# Altium project MainBoard.PrjPcb
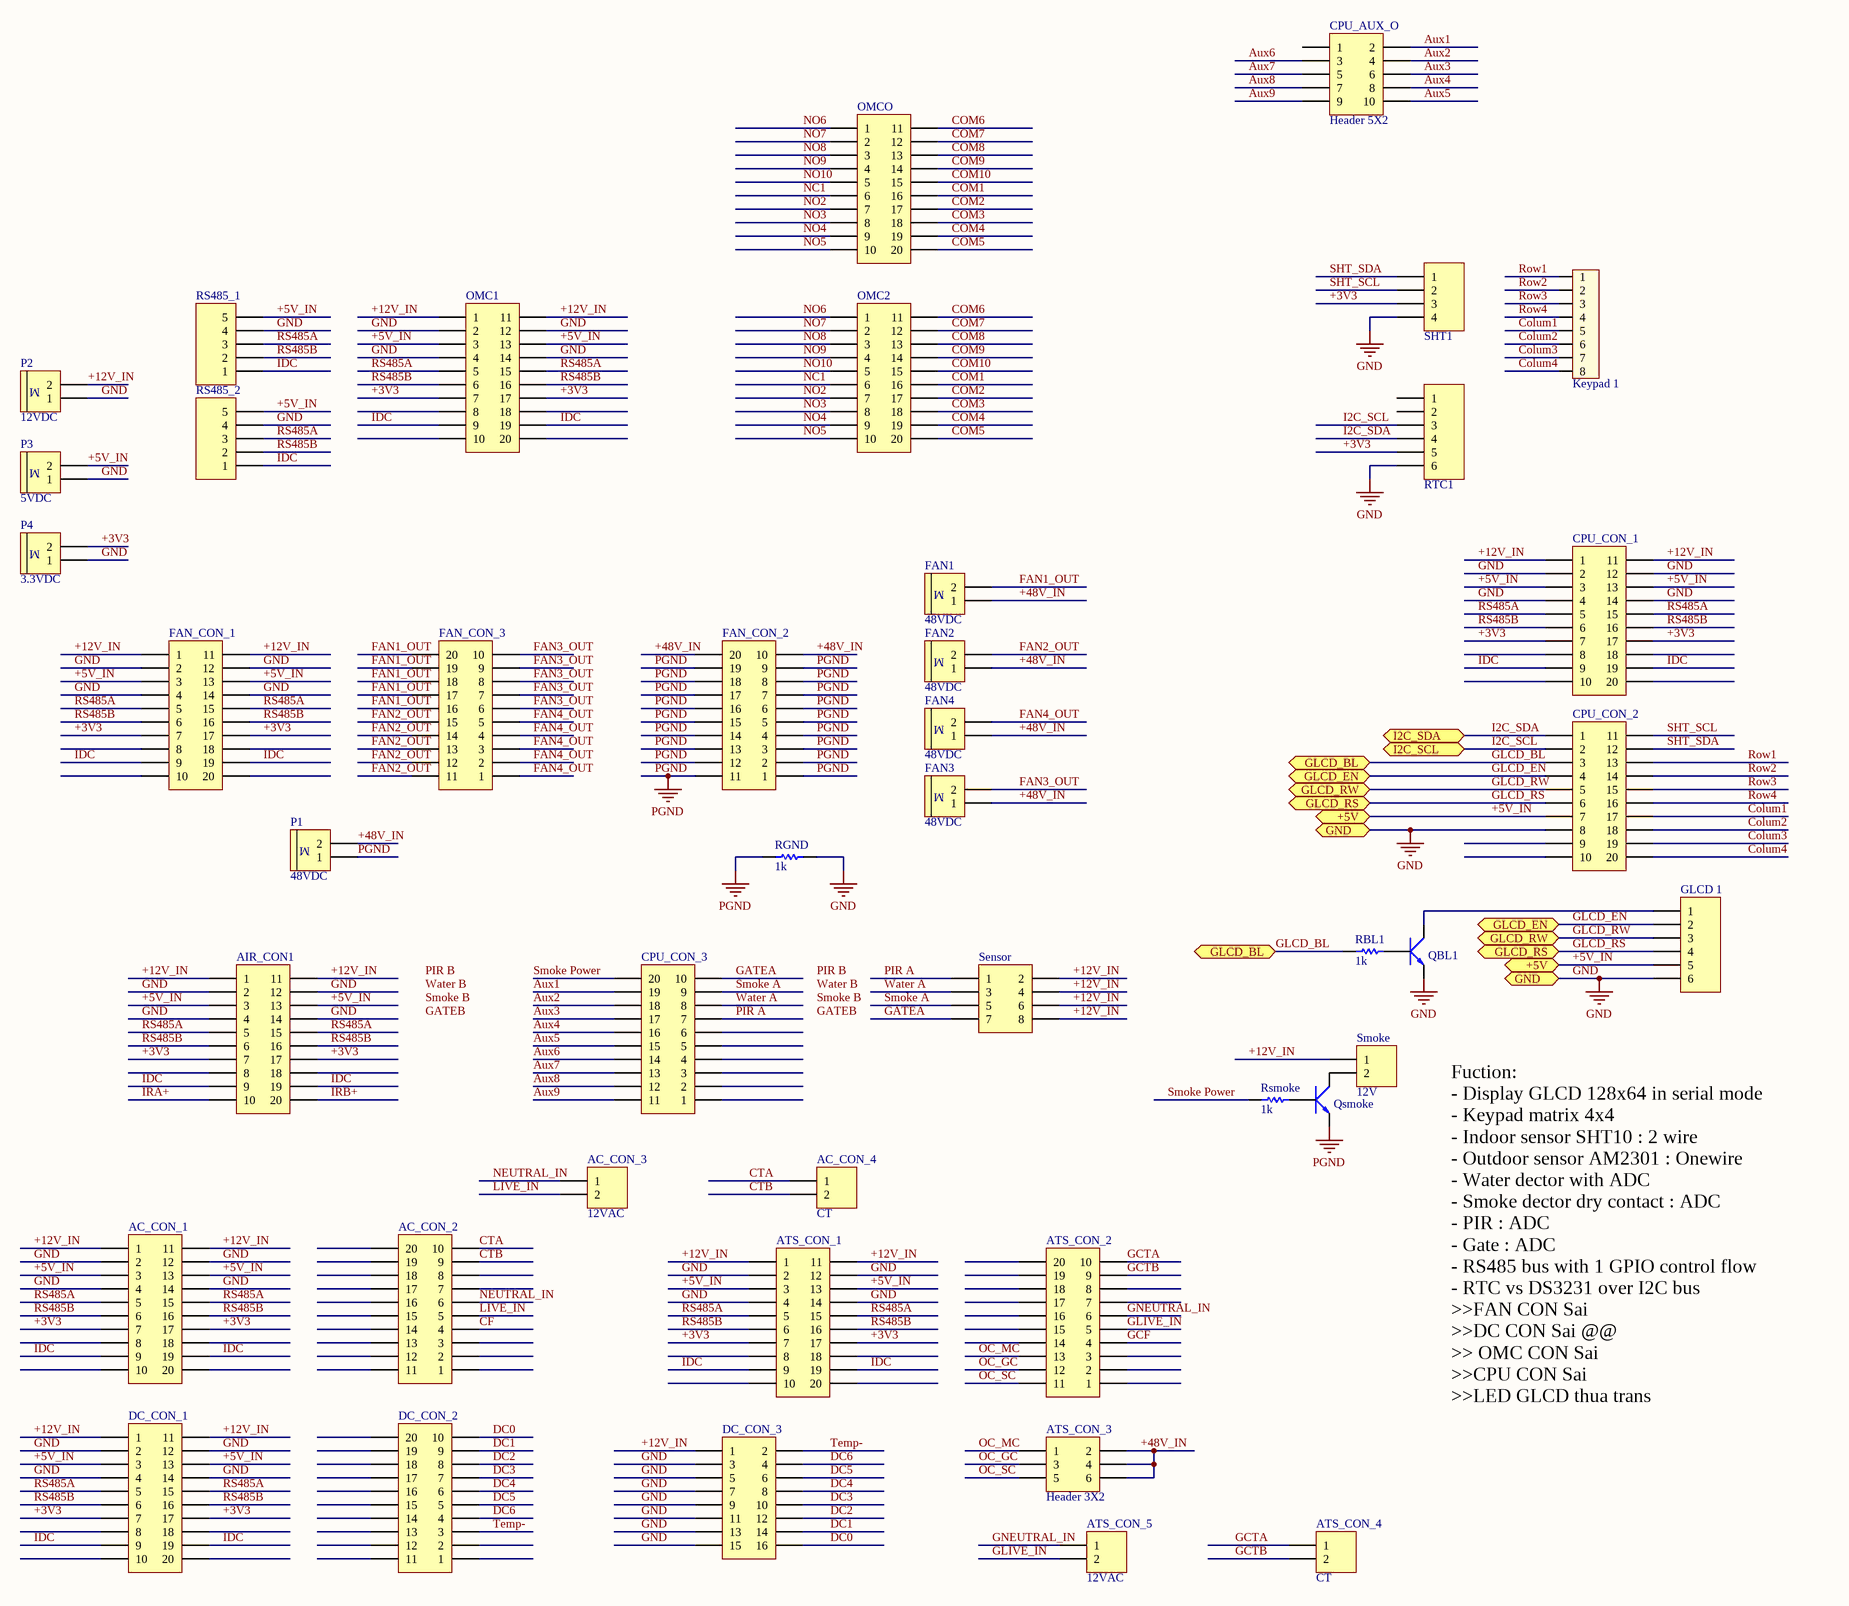
[diagram p0: MainBoard.SchDoc]
1 sheet, 44 parts. Net scope: flat (ports and power ports of the same name join across sheets).
Board file: MainBoard_Tuan.PcbDoc

## Sheet MainBoard.SchDoc
size A2

### Parts
AC_CON_1  Header 10X2A  [HDR2X10_CEN]  (value not drawn)
AC_CON_2  Header 10X2A  [HDR2X10_CEN]  (value not drawn)
AC_CON_3  12VAC  [HDR1X2]
AC_CON_4  CT  [HDR1X2]
AIR_CON1  Header 10X2A  [HDR2X10_CEN]  (value not drawn)
ATS_CON_1  Header 10X2A  [HDR2X10_CEN]  (value not drawn)
ATS_CON_2  Header 10X2A  [HDR2X10_CEN]  (value not drawn)
ATS_CON_3  Header 3X2  [HDR2X3]
ATS_CON_4  CT  [HDR1X2]
ATS_CON_5  12VAC  [HDR1X2]
CPU_AUX_O  Header 5X2  [HDR2X5]
CPU_CON_1  Header 10X2A  [HDR2X10_CEN]  (value not drawn)
CPU_CON_2  Header 10X2A  [HDR2X10_CEN]  (value not drawn)
CPU_CON_3  Header 10X2A  [HDR2X10_CEN]  (value not drawn)
DC_CON_1  Header 10X2A  [HDR2X10_CEN]  (value not drawn)
DC_CON_2  Header 10X2A  [HDR2X10_CEN]  (value not drawn)
DC_CON_3  Header 8X2  [HDR2X8]  (value not drawn)
FAN1  48VDC  [Medium - Header 2]
FAN2  48VDC  [Medium - Header 2]
FAN3  48VDC  [Medium - Header 2]
FAN4  48VDC  [Medium - Header 2]
FAN_CON_1  Header 10X2A  [HDR2X10_CEN]  (value not drawn)
FAN_CON_2  Header 10X2A  [HDR2X10_CEN]  (value not drawn)
FAN_CON_3  Header 10X2A  [HDR2X10_CEN]  (value not drawn)
GLCD_1  Header 6  [HDR1X6]  (value not drawn)
Keypad_1  JP8  [CON8]  (value not drawn)
OMC1  Header 10X2A  [HDR2X10_CEN]  (value not drawn)
OMC2  Header 10X2A  [HDR2X10_CEN]  (value not drawn)
OMCO  Header 10X2A  [HDR2X10_CEN]  (value not drawn)
P1  48VDC  [Medium - Header 2]
P2  12VDC  [Medium - Header 2]
P3  5VDC  [Medium - Header 2]
P4  3.3VDC  [Medium - Header 2]
QBL1  C828  [QTO-92B]  (value not drawn)
Qsmoke  C828  [QTO-92B]  (value not drawn)
RBL1  value 1k  [AXIAL-0.4]  (hidden comment: Res)
RGND  value 1k  [AXIAL-0.4]  (hidden comment: Res)
RS485_1  Header 5  [HDR1X5]  (value not drawn)
RS485_2  Header 5  [HDR1X5]  (value not drawn)
Rsmoke  value 1k  [AXIAL-0.4]  (hidden comment: Res)
RTC1  Header 6  [HDR1X6]  (value not drawn)
Sensor  Header 4X2  [HDR2X4]  (value not drawn)
SHT1  Header 4  [HDR1X4]  (value not drawn)
Smoke  12V  [HDR1X2]

### Ports
+5V, GLCD_BL, GLCD_EN, GLCD_RS, GLCD_RW, GND, I2C_SCL, I2C_SDA

### Nets
GND: AC_CON_1.2 AC_CON_1.4 AC_CON_1.12 AC_CON_1.14 AIR_CON1.2 AIR_CON1.4 AIR_CON1.12 AIR_CON1.14 ATS_CON_1.2 ATS_CON_1.4 ATS_CON_1.12 ATS_CON_1.14 CPU_CON_1.2 CPU_CON_1.4 CPU_CON_1.12 CPU_CON_1.14 CPU_CON_2.8 DC_CON_1.2 DC_CON_1.4 DC_CON_1.12 DC_CON_1.14 DC_CON_3.3 DC_CON_3.5 DC_CON_3.7 DC_CON_3.9 DC_CON_3.11 DC_CON_3.13 DC_CON_3.15 FAN_CON_1.2 FAN_CON_1.4 FAN_CON_1.12 FAN_CON_1.14 GLCD_1.6 OMC1.2 OMC1.4 OMC1.12 OMC1.14 P2.1 P3.1 P4.1 QBL1.3(E) RGND.2 RS485_1.4 RS485_2.4 RTC1.6 SHT1.4 ; port GND
PGND: FAN_CON_2.1 FAN_CON_2.2 FAN_CON_2.3 FAN_CON_2.4 FAN_CON_2.5 FAN_CON_2.6 FAN_CON_2.7 FAN_CON_2.8 FAN_CON_2.9 FAN_CON_2.11 FAN_CON_2.12 FAN_CON_2.13 FAN_CON_2.14 FAN_CON_2.15 FAN_CON_2.16 FAN_CON_2.17 FAN_CON_2.18 FAN_CON_2.19 P1.1 Qsmoke.3(E) RGND.1
+3V3: AC_CON_1.7 AC_CON_1.17 AIR_CON1.7 AIR_CON1.17 ATS_CON_1.7 ATS_CON_1.17 CPU_CON_1.7 CPU_CON_1.17 DC_CON_1.7 DC_CON_1.17 FAN_CON_1.7 FAN_CON_1.17 OMC1.7 OMC1.17 P4.2 RTC1.5 SHT1.3
+5V_IN: AC_CON_1.3 AC_CON_1.13 AIR_CON1.3 AIR_CON1.13 ATS_CON_1.3 ATS_CON_1.13 CPU_CON_1.3 CPU_CON_1.13 CPU_CON_2.7 DC_CON_1.3 DC_CON_1.13 FAN_CON_1.3 FAN_CON_1.13 GLCD_1.5 OMC1.3 OMC1.13 P3.2 RS485_1.5 RS485_2.5 ; port +5V
+12V_IN: AC_CON_1.1 AC_CON_1.11 AIR_CON1.1 AIR_CON1.11 ATS_CON_1.1 ATS_CON_1.11 CPU_CON_1.1 CPU_CON_1.11 DC_CON_1.1 DC_CON_1.11 DC_CON_3.1 FAN_CON_1.1 FAN_CON_1.11 OMC1.1 OMC1.11 P2.2 Sensor.2 Sensor.4 Sensor.6 Sensor.8 Smoke.1
+48V_IN: ATS_CON_3.2 ATS_CON_3.4 ATS_CON_3.6 FAN1.1 FAN2.1 FAN3.1 FAN4.1 FAN_CON_2.10 FAN_CON_2.20 P1.2
Aux1: CPU_AUX_O.2 CPU_CON_3.19
Aux2: CPU_AUX_O.4 CPU_CON_3.18
Aux3: CPU_AUX_O.6 CPU_CON_3.17
Aux4: CPU_AUX_O.8 CPU_CON_3.16
Aux5: CPU_AUX_O.10 CPU_CON_3.15
Aux6: CPU_AUX_O.3 CPU_CON_3.14
Aux7: CPU_AUX_O.5 CPU_CON_3.13
Aux8: CPU_AUX_O.7 CPU_CON_3.12
Aux9: CPU_AUX_O.9 CPU_CON_3.11
CF: AC_CON_2.4
Colum1: CPU_CON_2.17 Keypad_1.5
Colum2: CPU_CON_2.18 Keypad_1.6
Colum3: CPU_CON_2.19 Keypad_1.7
Colum4: CPU_CON_2.20 Keypad_1.8
COM1: OMC2.16 OMCO.16
COM2: OMC2.17 OMCO.17
COM3: OMC2.18 OMCO.18
COM4: OMC2.19 OMCO.19
COM5: OMC2.20 OMCO.20
COM6: OMC2.11 OMCO.11
COM7: OMC2.12 OMCO.12
COM8: OMC2.13 OMCO.13
COM9: OMC2.14 OMCO.14
COM10: OMC2.15 OMCO.15
CTA: AC_CON_2.10 AC_CON_4.1
CTB: AC_CON_2.9 AC_CON_4.2
DC0: DC_CON_2.10 DC_CON_3.16
DC1: DC_CON_2.9 DC_CON_3.14
DC2: DC_CON_2.8 DC_CON_3.12
DC3: DC_CON_2.7 DC_CON_3.10
DC4: DC_CON_2.6 DC_CON_3.8
DC5: DC_CON_2.5 DC_CON_3.6
DC6: DC_CON_2.4 DC_CON_3.4
FAN1_OUT: FAN1.2 FAN_CON_3.16 FAN_CON_3.17 FAN_CON_3.18 FAN_CON_3.19 FAN_CON_3.20
FAN2_OUT: FAN2.2 FAN_CON_3.11 FAN_CON_3.12 FAN_CON_3.13 FAN_CON_3.14 FAN_CON_3.15
FAN3_OUT: FAN3.2 FAN_CON_3.6 FAN_CON_3.7 FAN_CON_3.8 FAN_CON_3.9 FAN_CON_3.10
FAN4_OUT: FAN4.2 FAN_CON_3.1 FAN_CON_3.2 FAN_CON_3.3 FAN_CON_3.4 FAN_CON_3.5
GATEA: CPU_CON_3.10 Sensor.7
GCF: ATS_CON_2.4
GCTA: ATS_CON_2.10 ATS_CON_4.1
GCTB: ATS_CON_2.9 ATS_CON_4.2
GLCD_BL: CPU_CON_2.3 RBL1.1 ; port GLCD_BL
GLCD_EN: CPU_CON_2.4 GLCD_1.2 ; port GLCD_EN
GLCD_RS: CPU_CON_2.6 GLCD_1.4 ; port GLCD_RS
GLCD_RW: CPU_CON_2.5 GLCD_1.3 ; port GLCD_RW
GLIVE_IN: ATS_CON_2.5 ATS_CON_5.2
GNEUTRAL_IN: ATS_CON_2.6 ATS_CON_5.1
I2C_SCL: CPU_CON_2.2 RTC1.3 ; port I2C_SCL
I2C_SDA: CPU_CON_2.1 RTC1.4 ; port I2C_SDA
IDC: AC_CON_1.9 AC_CON_1.19 AIR_CON1.9 AIR_CON1.19 ATS_CON_1.9 ATS_CON_1.19 CPU_CON_1.9 CPU_CON_1.19 DC_CON_1.9 DC_CON_1.19 FAN_CON_1.9 FAN_CON_1.19 OMC1.9 OMC1.19 RS485_1.1 RS485_2.1
IRA+: AIR_CON1.10
IRB+: AIR_CON1.20
LIVE_IN: AC_CON_2.5 AC_CON_3.2
NC1: OMC2.6 OMCO.6
NEUTRAL_IN: AC_CON_2.6 AC_CON_3.1
NO2: OMC2.7 OMCO.7
NO3: OMC2.8 OMCO.8
NO4: OMC2.9 OMCO.9
NO5: OMC2.10 OMCO.10
NO6: OMC2.1 OMCO.1
NO7: OMC2.2 OMCO.2
NO8: OMC2.3 OMCO.3
NO9: OMC2.4 OMCO.4
NO10: OMC2.5 OMCO.5
OC_GC: ATS_CON_2.12 ATS_CON_3.3
OC_MC: ATS_CON_2.13 ATS_CON_3.1
OC_SC: ATS_CON_2.11 ATS_CON_3.5
PIR A: CPU_CON_3.7 Sensor.1
Row1: CPU_CON_2.13 Keypad_1.1
Row2: CPU_CON_2.14 Keypad_1.2
Row3: CPU_CON_2.15 Keypad_1.3
Row4: CPU_CON_2.16 Keypad_1.4
RS485A: AC_CON_1.5 AC_CON_1.15 AIR_CON1.5 AIR_CON1.15 ATS_CON_1.5 ATS_CON_1.15 CPU_CON_1.5 CPU_CON_1.15 DC_CON_1.5 DC_CON_1.15 FAN_CON_1.5 FAN_CON_1.15 OMC1.5 OMC1.15 RS485_1.3 RS485_2.3
RS485B: AC_CON_1.6 AC_CON_1.16 AIR_CON1.6 AIR_CON1.16 ATS_CON_1.6 ATS_CON_1.16 CPU_CON_1.6 CPU_CON_1.16 DC_CON_1.6 DC_CON_1.16 FAN_CON_1.6 FAN_CON_1.16 OMC1.6 OMC1.16 RS485_1.2 RS485_2.2
SHT_SCL: CPU_CON_2.11 SHT1.2
SHT_SDA: CPU_CON_2.12 SHT1.1
Smoke A: CPU_CON_3.9 Sensor.5
Smoke Power: CPU_CON_3.20 Rsmoke.1
Temp-: DC_CON_2.3 DC_CON_3.2
Water A: CPU_CON_3.8 Sensor.3
NetGLCD_1_1: GLCD_1.1 QBL1.2(C)
NetQBL1_1: QBL1.1(B) RBL1.2
NetQsmoke_1: Qsmoke.1(B) Rsmoke.2
NetQsmoke_2: Qsmoke.2(C) Smoke.2

Not connected (* = marked no-connect by the designer): AC_CON_1 8 10 18 20; AC_CON_2 1 2 3 7 8 11 12 13 14 15 16 17 18 19 20; AIR_CON1 8 18; ATS_CON_1 8 10 18 20; ATS_CON_2 1 2 3 7 8 14 15 16 17 18 19 20; CPU_AUX_O 1; CPU_CON_1 8 10 18 20; CPU_CON_2 9 10; CPU_CON_3 1 2 3 4 5 6; DC_CON_1 8 10 18 20; DC_CON_2 1 2 11 12 13 14 15 16 17 18 19 20; FAN_CON_1 8 10 18 20; OMC1 8 10 18 20; RTC1 1 2

### Notes on the sheet
- Fuction:
  - Display GLCD 128x64 in serial mode
  - Keypad matrix 4x4
  - Indoor sensor SHT10 : 2 wire
  - Outdoor sensor AM2301 : Onewire
  - Water dector with ADC
  - Smoke dector dry contact : ADC
  - PIR : ADC
  - Gate : ADC
  - RS485 bus with 1 GPIO control flow
  - RTC vs DS3231 over I2C bus
  >>FAN CON Sai
  >>DC CON Sai @@
  >> OMC CON Sai
  >>CPU CON Sai
  >>LED GLCD thua trans
- Labels drawn without touching a wire or pin: GATEB, PIR B, Smoke B, Water B
- (in symbol Header 2 - M) M

### Library data of the parts
AC_CON_1 AC_CON_2 AIR_CON1 ATS_CON_1 ATS_CON_2 CPU_CON_1-CPU_CON_3 DC_CON_1 DC_CON_2 FAN_CON_1-FAN_CON_3 OMC1 OMC2 OMCO = Header 10X2A: Header, 10-Pin, Dual row; LatestRevisionDate: 17-Jul-2002; LatestRevisionNote: Re-released for DXP Platform.; Publisher: Altium Limited
AC_CON_3 AC_CON_4 ATS_CON_4 ATS_CON_5 Smoke = Header 2: Header, 2-Pin; LatestRevisionDate: 17-Jul-2002; LatestRevisionNote: Re-released for DXP Platform.; Publisher: Altium Limited
ATS_CON_3 = Header 3X2: Header, 3-Pin, Dual row; LatestRevisionDate: 17-Jul-2002; LatestRevisionNote: Re-released for DXP Platform.; Publisher: Altium Limited
CPU_AUX_O = Header 5X2: Header, 5-Pin, Dual row; LatestRevisionDate: 17-Jul-2002; LatestRevisionNote: Re-released for DXP Platform.; Publisher: Altium Limited
DC_CON_3 = Header 8X2: Header, 8-Pin, Dual row; LatestRevisionDate: 17-Jul-2002; LatestRevisionNote: Re-released for DXP Platform.; Publisher: Altium Limited
FAN1-FAN4 P1-P4 = Header 2 - M: Header, 2-Pin, Medium; LatestRevisionDate: 17-Jul-2002; LatestRevisionNote: Re-released for DXP Platform.; Publisher: Altium Limited
GLCD_1 RTC1 = Header 6: Header, 6-Pin; LatestRevisionDate: 17-Jul-2002; LatestRevisionNote: Re-released for DXP Platform.; Publisher: Altium Limited
Keypad_1 = Con8: Connector 8; Value: Connector 8
QBL1 Qsmoke = NPN: Transistor C828 C1815....; pin to pad: 1>3 3>1
RS485_1 RS485_2 = Header 5: Header, 5-Pin; LatestRevisionDate: 17-Jul-2002; LatestRevisionNote: Re-released for DXP Platform.; Publisher: Altium Limited
Sensor = Header 4X2: Header, 4-Pin, Dual row; LatestRevisionDate: 17-Jul-2002; LatestRevisionNote: Re-released for DXP Platform.; Publisher: Altium Limited
SHT1 = Header 4: Header, 4-Pin; LatestRevisionDate: 17-Jul-2002; LatestRevisionNote: Re-released for DXP Platform.; Publisher: Altium Limited